# Altium schematic sheet S7CAS-PLEIADES-CARTE-MERE_P20_USB.SchDoc
size Tabloid; SheetNumber: 13; SheetTotal: 20; Sheet_Name: USB; Size: 11x17
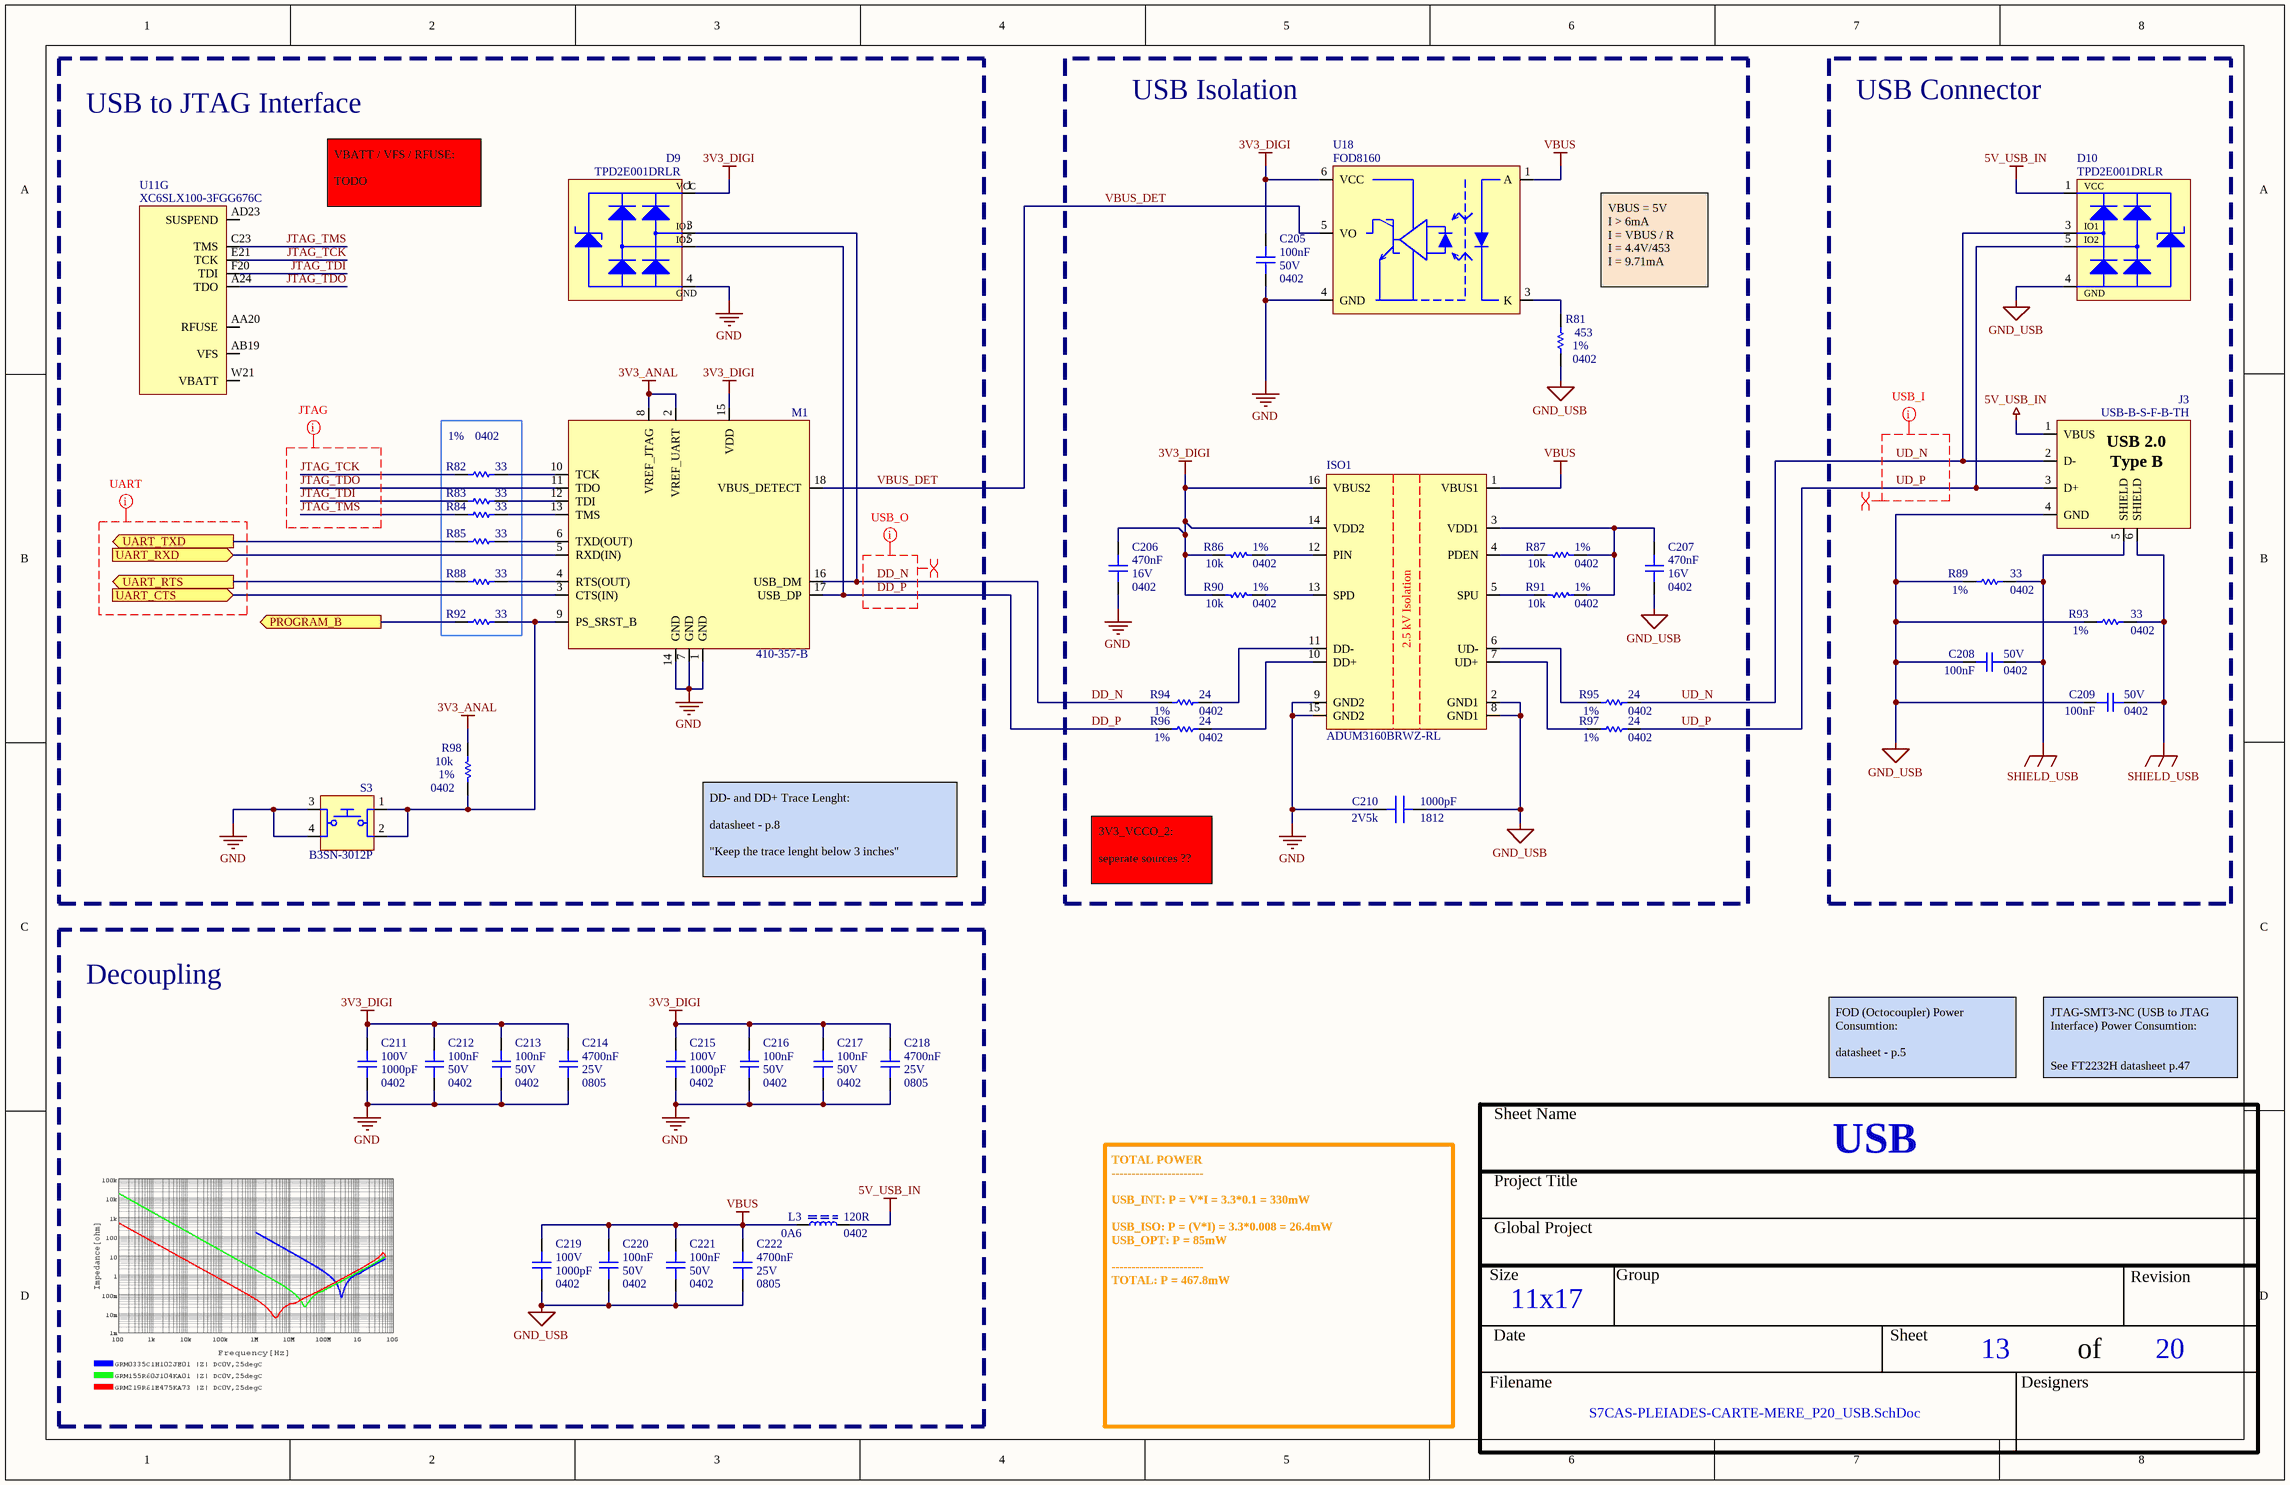
[diagram p0: S7CAS-PLEIADES-CARTE-MERE_P20_USB.SchDoc]

## Parts
C205  value 100nF  Voltage: 50V  Package: 0402  [CAP_0402]  (hidden comment: CAP - 0402)
C206  value 470nF  Voltage: 16V  Package: 0402  [CAP_0402]  (hidden comment: CAP - 0402)
C207  value 470nF  Voltage: 16V  Package: 0402  [CAP_0402]  (hidden comment: CAP - 0402)
C208  value 100nF  Voltage: 50V  Package: 0402  [CAP_0402]  (hidden comment: CAP - 0402)
C209  value 100nF  Voltage: 50V  Package: 0402  [CAP_0402]  (hidden comment: CAP - 0402)
C210  value 1000pF  Package: 1812  Voltage Rating: 2V5k  [CAP_CER_1812]  (hidden comment: 1812WC102KAT1A)
C211  value 1000pF  Voltage: 100V  Package: 0402  [CAP_0402]  (hidden comment: CAP - 0402)
C212  value 100nF  Voltage: 50V  Package: 0402  [CAP_0402]  (hidden comment: CAP - 0402)
C213  value 100nF  Voltage: 50V  Package: 0402  [CAP_0402]  (hidden comment: CAP - 0402)
C214  value 4700nF  Voltage: 25V  Package: 0805  [CAP_0805]  (hidden comment: CAP - 0805)
C215  value 1000pF  Voltage: 100V  Package: 0402  [CAP_0402]  (hidden comment: CAP - 0402)
C216  value 100nF  Voltage: 50V  Package: 0402  [CAP_0402]  (hidden comment: CAP - 0402)
C217  value 100nF  Voltage: 50V  Package: 0402  [CAP_0402]  (hidden comment: CAP - 0402)
C218  value 4700nF  Voltage: 25V  Package: 0805  [CAP_0805]  (hidden comment: CAP - 0805)
C219  value 1000pF  Voltage: 100V  Package: 0402  [CAP_0402]  (hidden comment: CAP - 0402)
C220  value 100nF  Voltage: 50V  Package: 0402  [CAP_0402]  (hidden comment: CAP - 0402)
C221  value 100nF  Voltage: 50V  Package: 0402  [CAP_0402]  (hidden comment: CAP - 0402)
C222  value 4700nF  Voltage: 25V  Package: 0805  [CAP_0805]  (hidden comment: CAP - 0805)
D9  TPD2E001DRLR  [TVS_USB_TPD2E001DRLR]
D10  TPD2E001DRLR  [TVS_USB_TPD2E001DRLR]
ISO1  ADUM3160BRWZ-RL  [ISO_ADUM3160BRWZ-RL]
J3  USB-B-S-F-B-TH  [CON_USB_USB-B-S-F-B-TH]
L3  value 120R  Current: 0A6  Package: 0402  [FER_0402]  (hidden comment: FER - 0402)
M1  410-357-B  [MOD_JTAG_410-357-B]
R81  value 453  Package: 0402  Precision: 1%  [RES_0402]  (hidden comment: RES - 0402)
R82  value 33  Package: 0402  Precision: 1%  [RES_0402]  (hidden comment: RES - 0402)
R83  value 33  [RES_0402]  (hidden comment: RES - 0402)
R84  value 33  [RES_0402]  (hidden comment: RES - 0402)
R85  value 33  [RES_0402]  (hidden comment: RES - 0402)
R86  value 10k  Package: 0402  Precision: 1%  [RES_0402]  (hidden comment: RES - 0402)
R87  value 10k  Package: 0402  Precision: 1%  [RES_0402]  (hidden comment: RES - 0402)
R88  value 33  [RES_0402]  (hidden comment: RES - 0402)
R89  value 33  Package: 0402  Precision: 1%  [RES_0402]  (hidden comment: RES - 0402)
R90  value 10k  Package: 0402  Precision: 1%  [RES_0402]  (hidden comment: RES - 0402)
R91  value 10k  Package: 0402  Precision: 1%  [RES_0402]  (hidden comment: RES - 0402)
R92  value 33  [RES_0402]  (hidden comment: RES - 0402)
R93  value 33  Package: 0402  Precision: 1%  [RES_0402]  (hidden comment: RES - 0402)
R94  value 24  Package: 0402  Precision: 1%  [RES_0402]  (hidden comment: RES - 0402)
R95  value 24  Package: 0402  Precision: 1%  [RES_0402]  (hidden comment: RES - 0402)
R96  value 24  Package: 0402  Precision: 1%  [RES_0402]  (hidden comment: RES - 0402)
R97  value 24  Package: 0402  Precision: 1%  [RES_0402]  (hidden comment: RES - 0402)
R98  value 10k  Package: 0402  Precision: 1%  [RES_0402]  (hidden comment: RES - 0402)
S3  B3SN-3012P  [SWI_TACT_B3SN-3012P]
U11  XC6SLX100-3FGG676C  [FPGA_XILINX_FGG676]  (part G of 10)
U18  FOD8160  [FOD8160]

## Blocks framed on the sheet
USB to JTAG Interface: D9 M1 R82-R85 R88 R92 R98 S3 U11
USB Isolation: C205-C207 C210 ISO1 R81 R86 R87 R90 R91 R94-R97 U18
USB Connector: C208 C209 D10 J3 R89 R93
Decoupling: C211-C222 L3

## Ports
PROGRAM_B (out), UART_CTS (in), UART_RTS (out), UART_RXD (in), UART_TXD (out)

## Nets
3V3_ANAL: M1.2(VREF_UART) M1.8(VREF_JTAG) R98.2
3V3_DIGI: C205.2 C206.2 C211.1 C212.2 C213.2 C214.2 C215.1 C216.2 C217.2 C218.2 D9.1(VCC) ISO1.14(VDD2) ISO1.16(VBUS2) M1.15(VDD) R86.2 R90.2 U18.6(VCC)
5V_USB_IN: D10.1(VCC) J3.1(VBUS) L3.1
GND: C205.1 C206.1 C210.2 C211.2 C212.1 C213.1 C214.1 C215.2 C216.1 C217.1 C218.1 D9.4(GND) ISO1.9(GND2) ISO1.15(GND2) M1.1(GND) M1.7(GND) M1.14(GND) S3.3 S3.4 U18.4(GND)
GND_USB: C207.1 C208.2 C209.2 C210.1 C219.2 C220.1 C221.1 C222.1 D10.4(GND) ISO1.2(GND1) ISO1.8(GND1) J3.4(GND) R81.1 R89.2 R93.2
SHIELD_USB: C208.1 C209.1 J3.5(SHIELD) J3.6(SHIELD) R89.1 R93.1
VBUS: C219.1 C220.2 C221.2 C222.2 ISO1.1(VBUS1) L3.2 U18.1(A)
DD_N: D9.3(IO1) M1.16(USB_DM) R94.2
DD_P: D9.5(IO2) M1.17(USB_DP) R96.2
JTAG_TCK: R82.2 U11.E21(TCK)
JTAG_TDI: R83.2 U11.F20(TDI)
JTAG_TDO: M1.11(TDO) U11.A24(TDO)
JTAG_TMS: R84.2 U11.C23(TMS)
PROGRAM_B: R92.2 ; port PROGRAM_B
UART_CTS: M1.3(CTS(IN)) ; port UART_CTS
UART_RTS: R88.2 ; port UART_RTS
UART_RXD: M1.5(RXD(IN)) ; port UART_RXD
UART_TXD: R85.2 ; port UART_TXD
UD_N: D10.3(IO1) J3.2(D-) R95.1
UD_P: D10.5(IO2) J3.3(D+) R97.1
VBUS_DET: M1.18(VBUS_DETECT) U18.5(VO)
NetC207_2: C207.2 ISO1.3(VDD1) R87.1 R91.1
NetISO1_4: ISO1.4(PDEN) R87.2
NetISO1_5: ISO1.5(SPU) R91.2
NetISO1_6: ISO1.6(UD-) R95.2
NetISO1_7: ISO1.7(UD+) R97.2
NetISO1_10: ISO1.10(DD+) R96.1
NetISO1_11: ISO1.11(DD-) R94.1
NetISO1_12: ISO1.12(PIN) R86.1
NetISO1_13: ISO1.13(SPD) R90.1
NetM1_4: M1.4(RTS(OUT)) R88.1
NetM1_6: M1.6(TXD(OUT)) R85.1
NetM1_9: M1.9(PS_SRST_B) R92.1 R98.1 S3.1 S3.2
NetM1_10: M1.10(TCK) R82.1
NetM1_12: M1.12(TDI) R83.1
NetM1_13: M1.13(TMS) R84.1
NetR81_2: R81.2 U18.3(K)

Not connected (* = marked no-connect by the designer): D9 2(NC); D10 2(NC); U11 AA20(RFUSE) AB19(VFS) AD23(SUSPEND) W21(VBATT)

## Layout directives
net class TRACKS_50: (no net found under the mark), DD_N, DD_P, JTAG_TCK, JTAG_TDI, JTAG_TDO, JTAG_TMS, UD_N, UD_P
differential pair: DD_N, DD_P, UD_N, UD_P

## Notes on the sheet
- VBATT / VFS / RFUSE:
  TODO
- VBUS = 5V
  I > 6mA
  I = VBUS / R
  I = 4.4V/453
  I = 9.71mA
- DD- and DD+ Trace Lenght:
  datasheet - p.8
  "Keep the trace lenght below 3 inches"
- 3V3_VCCO_2:
  seperate sources ??
- FOD (Octocoupler) Power Consumtion:
  datasheet - p.5
- JTAG-SMT3-NC (USB to JTAG Interface) Power Consumtion:
  See FT2232H datasheet p.47
  (https://ftdichip.com/wp-content/uploads/2020/08/DS_FT2232H.pdf)
- TOTAL POWER
  -----------------------
  USB_INT: P = V*I = 3.3*0.1 = 330mW
  USB_ISO: P = (V*I) = 3.3*0.008 = 26.4mW
  USB_OPT: P = 85mW
  -----------------------
  TOTAL: P = 467.8mW
- Sheet Name
- Project Title
- Global Project
- Size
- Group
- Revision
- Date
- Sheet
- of
- Filename
- Designers
- (in symbol CON_USB_USB-B-S-F-B-TH) USB 2.0; Type B
- (in symbol ISO_ADUM3160BRWZ-RL) 2.5 kV Isolation

## Library data of the parts
C205 C208 C209 C212 C213 C216 C217 C220 C221 = CAP - 0402: Mfg Part Number: GRM155R61H104KE14; Precision: 10%; Current: *; CreatedBy: Jonathan Bouchard; Power: *
C206 C207 = CAP - 0402: Mfg Part Number: GXT155R61C474KE01; Precision: 10%; Current: *; CreatedBy: Jonathan Bouchard; Power: *
C210 = CAP_CER_1812WC102KAT1A: CAP - CER 1000PF 2.5KV X7R - 1812; Tolerance: 10%; GRAMS Lib Spec: 2.7; Temperature: -55 to 125C
C211 C215 C219 = CAP - 0402: Mfg Part Number: GRM155R72A102KA01; Precision: 10%; Current: *; CreatedBy: Jonathan Bouchard; Power: *
C214 C218 C222 = CAP - 0805: Mfg Part Number: GRM219R61E475KA73; Precision: 10%; Current: *; CreatedBy: Jonathan Bouchard; Power: *
D9 D10 = TVS_USB_TPD2E001DRLR: TVS - USB TVS DIODE 5.5V - SOT-553; Manufacturer #1: Texas Instruments; Value: 11V Breakdown; Voltage Rating: 5.5V (Max); GRAMS Lib Spec: 2.8; Magnetic Material: YES; Cryo: UNKNOWN; Tolerance: *; Current Rating: *; Power Max: *; HelpURL: http://www.ti.com/lit/ds/symlink/tpd2e001.pdf; CreatedBy/Date: Jonathan Bouchard 2018-07-10; VerifiedBy: Arnaud Samson 16-07-18; Temperature: -40°C ~ 85°C (TA); Package: SOT-553; Manufacturer #2: *; Note: *; Assembly Type: SMD; Part Number #2: *; Part Number #1: TPD2E001DRLR; Polarized: YES; Supplier 1: Digi-Key; Supplier Part Number 1: 296-21883-1-ND; Mfg Part Number: TPD2E001DRLR
ISO1 = ISO_ADUM3160BRWZ-RL: ISO - DGTL ISO 2.5KV 2CH USB - 16SOIC; Manufacturer #1: Analog Devices; Value: 2500Vrms voltage isolation; Voltage Rating: 3~5.5V; GRAMS Lib Spec: 2.8; Magnetic Material: UNKNOWN; Polarized: Yes; Tolerance: *; Current Rating: *; Power Max: *; HelpURL: https://www.analog.com/media/en/technical-documentation/data-sheets/ADuM3160.pdf; CreatedBy/Date: Tommy Rossignol 2018-11-16; VerifiedBy: Caroline Paulin - 13 février 2019; Temperature: -40°C ~ 105°C; Package: 16-SOIC; Manufacturer #2: *; Assembly Type: SMD; Part Number #2: *; Part Number #1: ADUM3160BRWZ-RL; Supplier 1: Digi-Key; Supplier Part Number 1: ADUM3160BRWZ-RLCT-ND; Cryo: UNKNOWN; Mfg Part Number: ADUM3160BRWZ-RL
J3 = CON_USB_USB-B-S-F-B-TH: CON - USB B RECPT TH R/A - 4-TH; Manufacturer #1: Samtec Inc.; Value: USB B; Voltage Rating: 30VAC; GRAMS Lib Spec: 2.8c; Magnetic Material: UNKNOWN; Polarized: YES; Tolerance: *; Current Rating: *; Power Max: *; HelpURL: http://suddendocs.samtec.com/catalog_english/usb_b.pdf; CreatedBy/Date: Jonathan Bouchard 2020-03-24; VerifiedBy: C.Paulin - 22/04/2020; Temperature: -50°C ~ 85°C; Package: 4-TH; Manufacturer #2: *; Note: *; Assembly Type: TH; Part Number #2: *; Part Number #1: USB-B-S-F-B-TH; Supplier 1: Digi-Key; Supplier Part Number 1: SAM10867-ND; Cryo: UNKNOWN; Mfg Part Number: CON_USB_USB-B-S-F-B-TH
L3 = FER - 0402: Mfg Part Number: BLM15BX121SN1; Voltage: *; CreatedBy: Jonathan Bouchard; Power: *; Precision: *
M1 = MOD_JTAG_410-357-B: MOD - JTAG-SMT3-NC Programming Module For Xilinx FPGA - 18-SMT; Manufacturer #1: Digilent; Voltage Rating: VDD: 2.97V~3.63V, VJTAG/VUART: 1.65V~5.5V; GRAMS Lib Spec: 2.8; Note: Prior to reflow, the JTAG-SMT3-NC module must be dried at 125°C for 17 hours; Magnetic Material: Unknown; Polarized: Yes; Value: *; Tolerance: *; Current Rating: *; Power Max: *; HelpURL: https://reference.digilentinc.com/_media/reference/programmers/jtag-smt3/jtag-smt3-nc_rm.pdf; CreatedBy/Date: Tommy Rossignol 2018-11-23; VerifiedBy: Nicolas V. (2019-01-28); Temperature: -40°C ~ 85°C; Package: 18-pad SMT; Manufacturer #2: *; Assembly Type: SMD; Part Number #2: *; Part Number #1: 410-357-B; Supplier 1: Digi-Key; Supplier Part Number 1: 1286-1196-ND; Cryo: UNKNOWN
R81 = RES - 0402: Mfg Part Number: RGC1/16SC6980FTH; Voltage: 50V; Power: 1/16W; Current: *; CreatedBy: Jonathan Bouchard
R82 R89 R93 = RES - 0402: Voltage: 50V; Power: 1/16W; Current: *; CreatedBy: Jonathan Bouchard
R83-R85 R88 R92 = RES - 0402: Voltage: 50V; Power: 1/16W; Precision: 1%; Current: *; CreatedBy: Jonathan Bouchard; Package: 0402
R86 R87 R90 R91 R98 = RES - 0402: Mfg Part Number: MCS04020C1002FE000; Voltage: 50V; Power: 1/16W; Current: *; CreatedBy: Jonathan Bouchard
R94-R97 = RES - 0402: Mfg Part Number: MCS04020C2409FE000; Voltage: 50V; Power: 1/16W; Current: *; CreatedBy: Jonathan Bouchard
S3 = SWI_TACT_B3SN-3012P_1: SWI - SWITCH TACTILE SPST-NO 0.05A 24V -SMD; Manufacturer #1: Omron Electronics Inc-EMC Div; Current Rating: 50mA; Voltage rating: 24VDC; Polarized: No; Magnetic Material: UNKNOWN; GRAMS Lib Spec: 2.8; Manufacturer #2: *; Power Max: *; Value: SPST-NO; Part Number #1: B3SN-3012P; Part Number #2: *; HelpURL: http://omronfs.omron.com/en_US/ecb/products/pdf/en-b3sn.pdf; Supplier 1: Digi-Key; Supplier Part Number 1: SW261CT-ND; Assembly Type: SMD; Temperature: -25°C ~ 70°C; Package: SMD; CreatedBy/Date: Olivier Bernard / 5/12/2017; Tolerance: *; VerifiedBy: Caroline Paulin / 11 juillet 2018; Cryo: UNKNOWN; Mfg Part Number: B3SN-3012P
U11 = FPGA_XC6SLX100-3FGG676C: FPGA - XILINX SPARTAN 6 480 I/O - BGA-676; Voltage: 1.14 V ~ 1.26 V; Current: *; Power: *; Mfg: Xilinx; Mfg Part Number: XC6SLX100-3FGG676C; HelpURL: https://www.xilinx.com/support/documentation/data_sheets/ds162.pdf; CreatedBy: Jonathan Bouchard; Temperature: 0°C ~ 85°C (TJ); Value: *; Precision: *; Package: BGA-676; Supplier 1: Digikey; Supplier Part Number 1: 122-1760-ND
U18 = OCTOCOUPLER_FOD8160: XXX - Description - Package; GRAMS Lib Spec: 2.7; HelpURL: https://www.onsemi.com/pdf/datasheet/fod8160-d.pdf; Mfg Part Number: FOD8160